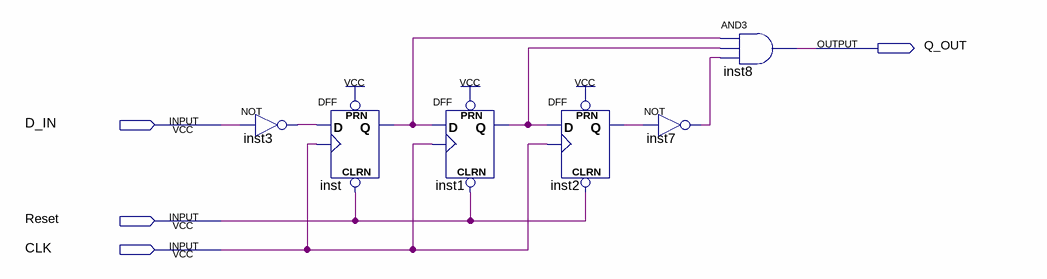
[diagram p0: schematic sheet]
// Quartus schematic Debouncer.bdf as structural Verilog: 6 symbols, 4 pins
module Debouncer (
  input  D_IN,
  input  Reset,
  input  CLK,
  output Q_OUT
);

  wire inst1_q, inst2_q, inst3_out, inst7_out, inst_q;

  not inst3 (inst3_out, D_IN);
  DFF inst (.CLRN(Reset), .CLK(CLK), .D(inst3_out), .PRN(1'b1), .Q(inst_q));
  DFF inst1 (.CLRN(Reset), .CLK(CLK), .D(inst_q), .PRN(1'b1), .Q(inst1_q));
  DFF inst2 (.CLRN(Reset), .CLK(CLK), .D(inst1_q), .PRN(1'b1), .Q(inst2_q));
  not inst7 (inst7_out, inst2_q);
  and inst8 (Q_OUT, inst_q, inst1_q, inst7_out);
endmodule
